# Altium schematic sheet 飞控第二代.SchDoc
size A3
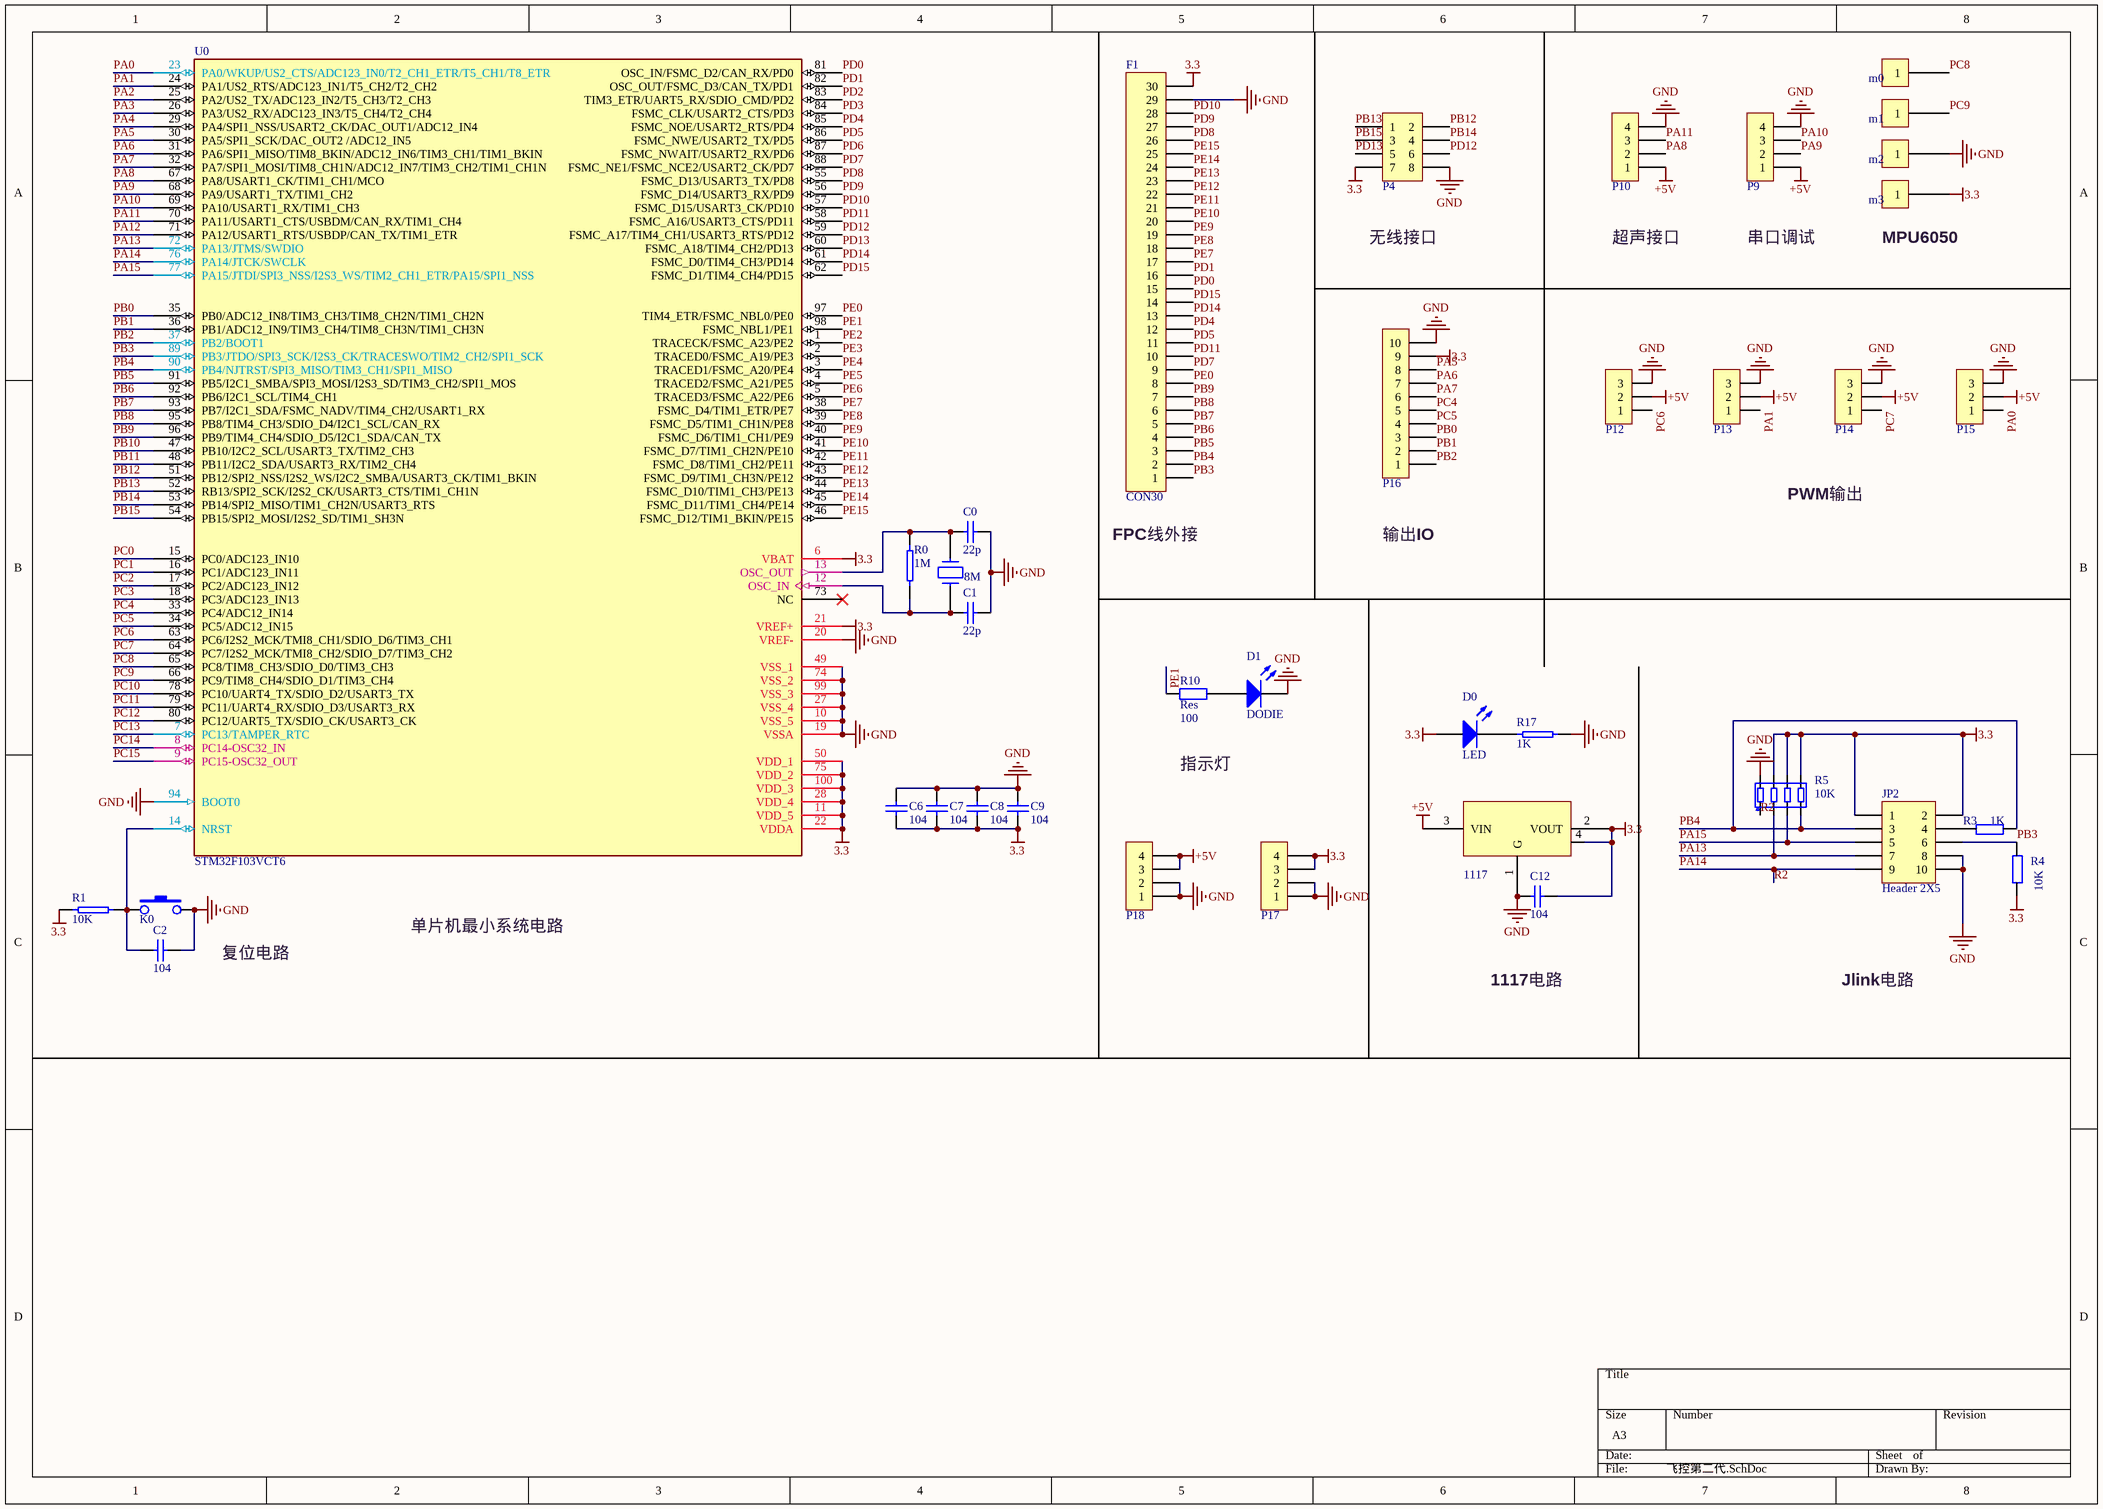
[diagram p0: 飞控第二代.SchDoc]

## Parts
8M  CRY  [晶振-2]  (value not drawn)
?  1117  [SOT-223]
C0  22p  [0603]
C1  22p  [0603]
C2  104  [0603]
C6  104  [0603]
C7  104  [0603]
C8  104  [0603]
C9  104  [0603]
C12  104  [0603]
D0  LED  [0805D]
D1  DODIE  [0805D]
F1  CON30  [FFC_30P_0.5MM]
JP2  Header 2X5  [IDC10L 2.00mm]
K0  BUTTON  [K1]  (value not drawn)
m0  (no value)  [SIP1-T]
m1  (no value)  [SIP1-T]
m2  (no value)  [SIP1-T]
m3  (no value)  [SIP1-T]
P4  IDC4  [IDC4]  (value not drawn)
P9  CON4  [SIP4]  (value not drawn)
P10  CON4  [SIP4]  (value not drawn)
P12  CON3  [SIP3-T0]  (value not drawn)
P13  CON3  [SIP3-T0]  (value not drawn)
P14  CON3  [SIP3-T0]  (value not drawn)
P15  CON3  [SIP3-T0]  (value not drawn)
P16  CON10  [SIP10-T0]  (value not drawn)
P17  CON4  [SIP4-T0]  (value not drawn)
P18  CON4  [SIP4-T0]  (value not drawn)
R0  1M  [0603]
R1  10K  [0603]
R3  1K  [0603]
R4  10K  [0603]
R5  10K  [0603*4]
R10  Res  value 100  [0603]
R17  1K  [0603]
U0  STM32F103VCT6  [LQFP100]

## Nets
3.3: ?.2(VOUT) ?.4 C6.1 C7.1 C8.1 C9.1 C12.2 D0.1 F1.30 JP2.1 JP2.2 m3.0(1) P4.7 P16.9 P17.3 P17.4 R1.2 R4.1 R5.5 R5.6 R5.7 U0.6(VBAT) U0.11(VDD_5) U0.21(VREF+) U0.22(VDDA) U0.28(VDD_4) U0.50(VDD_1) U0.75(VDD_2) U0.100(VDD_3)
+5V: ?.3(VIN) P9.1 P10.1 P12.2 P13.2 P14.2 P15.2 P18.3 P18.4
GND: ?.1(G) C0.1 C1.1 C2.1 C6.2 C7.2 C8.2 C9.2 C12.1 D1.2 F1.29 JP2.8 JP2.10 K0.2 m2.0(1) P4.8 P9.4 P10.4 P12.3 P13.3 P14.3 P15.3 P16.10 P17.1 P17.2 P18.1 P18.2 R5.8 R17.1 U0.10(VSS_5) U0.19(VSSA) U0.20(VREF-) U0.27(VSS_4) U0.49(VSS_1) U0.74(VSS_2) U0.94(BOOT0) U0.99(VSS_3)
PA0: P15.1 U0.23(PA0/WKUP/US2_CTS/ADC123_IN0/T2_CH1_ETR/T5_CH1/T8_ETR)
PA1: P13.1 U0.24(PA1/US2_RTS/ADC123_IN1/T5_CH2/T2_CH2)
PA2: U0.25(PA2/US2_TX/ADC123_IN2/T5_CH3/T2_CH3)
PA3: U0.26(PA3/US2_RX/ADC123_IN3/T5_CH4/T2_CH4)
PA4: U0.29(PA4/SPI1_NSS/USART2_CK/DAC_OUT1/ADC12_IN4)
PA5: P16.8 U0.30(PA5/SPI1_SCK/DAC_OUT2_/ADC12_IN5)
PA6: P16.7 U0.31(PA6/SPI1_MISO/TIM8_BKIN/ADC12_IN6/TIM3_CH1/TIM1_BKIN)
PA7: P16.6 U0.32(PA7/SPI1_MOSI/TIM8_CH1N/ADC12_IN7/TIM3_CH2/TIM1_CH1N)
PA8: P10.2 U0.67(PA8/USART1_CK/TIM1_CH1/MCO)
PA9: P9.2 U0.68(PA9/USART1_TX/TIM1_CH2)
PA10: P9.3 U0.69(PA10/USART1_RX/TIM1_CH3)
PA11: P10.3 U0.70(PA11/USART1_CTS/USBDM/CAN_RX/TIM1_CH4)
PA12: U0.71(PA12/USART1_RTS/USBDP/CAN_TX/TIM1_ETR)
PA13: JP2.7 R5.2 U0.72(PA13/JTMS/SWDIO)
PA14: JP2.9 R5.1 U0.76(PA14/JTCK/SWCLK)  [also labelled R2]
PA15: JP2.5 R5.3 U0.77(PA15/JTDI/SPI3_NSS/I2S3_WS/TIM2_CH1_ETR/PA15/SPI1_NSS)
PB0: P16.3 U0.35(PB0/ADC12_IN8/TIM3_CH3/TIM8_CH2N/TIM1_CH2N)
PB1: P16.2 U0.36(PB1/ADC12_IN9/TIM3_CH4/TIM8_CH3N/TIM1_CH3N)
PB2: P16.1 U0.37(PB2/BOOT1)
PB3: F1.1 JP2.6 R4.2 U0.89(PB3/JTDO/SPI3_SCK/I2S3_CK/TRACESWO/TIM2_CH2/SPI1_SCK)
PB4: F1.2 JP2.3 R3.2 R5.4 U0.90(PB4/NJTRST/SPI3_MISO/TIM3_CH1/SPI1_MISO)
PB5: F1.3 U0.91(PB5/I2C1_SMBA/SPI3_MOSI/I2S3_SD/TIM3_CH2/SPI1_MOS)
PB6: F1.4 U0.92(PB6/I2C1_SCL/TIM4_CH1)
PB7: F1.5 U0.93(PB7/I2C1_SDA/FSMC_NADV/TIM4_CH2/USART1_RX)
PB8: F1.6 U0.95(PB8/TIM4_CH3/SDIO_D4/I2C1_SCL/CAN_RX)
PB9: F1.7 U0.96(PB9/TIM4_CH4/SDIO_D5/I2C1_SDA/CAN_TX)
PB10: U0.47(PB10/I2C2_SCL/USART3_TX/TIM2_CH3)
PB11: U0.48(PB11/I2C2_SDA/USART3_RX/TIM2_CH4)
PB12: P4.2 U0.51(PB12/SPI2_NSS/I2S2_WS/I2C2_SMBA/USART3_CK/TIM1_BKIN)
PB13: P4.1 U0.52(RB13/SPI2_SCK/I2S2_CK/USART3_CTS/TIM1_CH1N)
PB14: P4.4 U0.53(PB14/SPI2_MISO/TIM1_CH2N/USART3_RTS)
PB15: P4.3 U0.54(PB15/SPI2_MOSI/I2S2_SD/TIM1_SH3N)
PC0: U0.15(PC0/ADC123_IN10)
PC1: U0.16(PC1/ADC123_IN11)
PC2: U0.17(PC2/ADC123_IN12)
PC3: U0.18(PC3/ADC123_IN13)
PC4: P16.5 U0.33(PC4/ADC12_IN14)
PC5: P16.4 U0.34(PC5/ADC12_IN15)
PC6: P12.1 U0.63(PC6/I2S2_MCK/TMI8_CH1/SDIO_D6/TIM3_CH1)
PC7: P14.1 U0.64(PC7/I2S2_MCK/TMI8_CH2/SDIO_D7/TIM3_CH2)
PC8: m0.0(1) U0.65(PC8/TIM8_CH3/SDIO_D0/TIM3_CH3)
PC9: m1.0(1) U0.66(PC9/TIM8_CH4/SDIO_D1/TIM3_CH4)
PC10: U0.78(PC10/UART4_TX/SDIO_D2/USART3_TX)
PC11: U0.79(PC11/UART4_RX/SDIO_D3/USART3_RX)
PC12: U0.80(PC12/UART5_TX/SDIO_CK/USART3_CK)
PC13: U0.7(PC13/TAMPER_RTC)
PC14: U0.8(PC14-OSC32_IN)
PC15: U0.9(PC15-OSC32_OUT)
PD0: F1.15 U0.81(OSC_IN/FSMC_D2/CAN_RX/PD0)
PD1: F1.16 U0.82(OSC_OUT/FSMC_D3/CAN_TX/PD1)
PD2: U0.83(TIM3_ETR/UART5_RX/SDIO_CMD/PD2)
PD3: U0.84(FSMC_CLK/USART2_CTS/PD3)
PD4: F1.12 U0.85(FSMC_NOE/USART2_RTS/PD4)
PD5: F1.11 U0.86(FSMC_NWE/USART2_TX/PD5)
PD6: U0.87(FSMC_NWAIT/USART2_RX/PD6)
PD7: F1.9 U0.88(FSMC_NE1/FSMC_NCE2/USART2_CK/PD7)
PD8: F1.26 U0.55(FSMC_D13/USART3_TX/PD8)
PD9: F1.27 U0.56(FSMC_D14/USART3_RX/PD9)
PD10: F1.28 U0.57(FSMC_D15/USART3_CK/PD10)
PD11: F1.10 U0.58(FSMC_A16/USART3_CTS/PD11)
PD12: P4.6 U0.59(FSMC_A17/TIM4_CH1/USART3_RTS/PD12)
PD13: P4.5 U0.60(FSMC_A18/TIM4_CH2/PD13)
PD14: F1.13 U0.61(FSMC_D0/TIM4_CH3/PD14)
PD15: F1.14 U0.62(FSMC_D1/TIM4_CH4/PD15)
PE0: F1.8 U0.97(TIM4_ETR/FSMC_NBL0/PE0)
PE1: R10.2 U0.98(FSMC_NBL1/PE1)
PE2: U0.1(TRACECK/FSMC_A23/PE2)
PE3: U0.2(TRACED0/FSMC_A19/PE3)
PE4: U0.3(TRACED1/FSMC_A20/PE4)
PE5: U0.4(TRACED2/FSMC_A21/PE5)
PE6: U0.5(TRACED3/FSMC_A22/PE6)
PE7: F1.17 U0.38(FSMC_D4/TIM1_ETR/PE7)
PE8: F1.18 U0.39(FSMC_D5/TIM1_CH1N/PE8)
PE9: F1.19 U0.40(FSMC_D6/TIM1_CH1/PE9)
PE10: F1.20 U0.41(FSMC_D7/TIM1_CH2N/PE10)
PE11: F1.21 U0.42(FSMC_D8/TIM1_CH2/PE11)
PE12: F1.22 U0.43(FSMC_D9/TIM1_CH3N/PE12)
PE13: F1.23 U0.44(FSMC_D10/TIM1_CH3/PE13)
PE14: F1.24 U0.45(FSMC_D11/TIM1_CH4/PE14)
PE15: F1.25 U0.46(FSMC_D12/TIM1_BKIN/PE15)
Net8M_1: 8M.1 C1.2 R0.1 U0.12(OSC_IN)
Net8M_2: 8M.2 C0.2 R0.2 U0.13(OSC_OUT)
NetC2_2: C2.2 K0.1 R1.1 U0.14(NRST)
NetD0_2: D0.2 R17.2
NetD1_1: D1.1 R10.1
NetJP2_4: JP2.4 R3.1

Not connected (* = marked no-connect by the designer): U0 73(NC)*

## Notes on the sheet
- 无线接口
- 超声接口
- 串口调试
- (near m3) MPU6050
- PWM输出
- (near F1) FPC线外接
- 输出IO
- 指示灯
- 复位电路
- 单片机最小系统电路
- 1117电路
- Jlink电路

## Library data of the parts
C0-C2 C6-C9 C12 = CAP
D1 = LED
JP2 = Header: Header, 5-Pin, Dual row; Manufacturer: Generic Components; Class: Connector
m0-m3 = CON1
R0 R1 R17 = RES
R3 R4 = R
R5 = RES*4
R10 = Res: Resistor; Manufacturer: Generic Components; Class: Passive; Published: 08/06/2000; Publisher: Altium Hobart Technology Centre; SubClass: Resistor
U0 = STM32F103VCT6: STM32 ARM-based 32-bit MCU with 64 Kbytes Flash, 100-pin LQFP, Industrial Temperature; Published: *; DatasheetVersion: *; PackageVersion: *; PackageReference: *; Publisher: *; PackageDescription: *; ComponentLink1Description: *; ComponentLink1URL: *; ComponentLink2Description: *; ComponentLink2URL: *